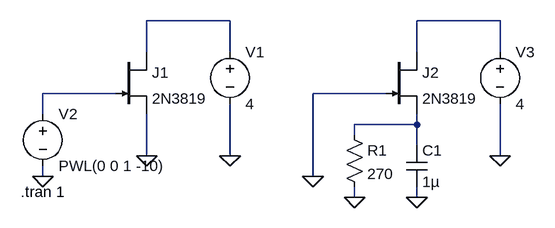
[diagram p0: schematic DC.asc]
DC.asc, the LTspice schematic file:
Version 4
SHEET 1 880 680
WIRE 320 64 192 64
WIRE 736 64 608 64
WIRE 192 112 192 64
WIRE 320 112 320 64
WIRE 608 112 608 64
WIRE 736 112 736 64
WIRE 144 176 32 176
WIRE 560 176 448 176
WIRE 32 208 32 176
WIRE 608 224 608 208
WIRE 608 224 512 224
WIRE 512 240 512 224
WIRE 608 256 608 224
WIRE 192 272 192 208
WIRE 320 272 320 192
WIRE 736 272 736 192
WIRE 32 304 32 288
WIRE 448 304 448 176
WIRE 512 336 512 320
WIRE 608 336 608 320
FLAG 192 272 0
FLAG 32 304 0
FLAG 320 272 0
FLAG 448 304 0
FLAG 736 272 0
FLAG 512 336 0
FLAG 608 336 0
SYMBOL njf 144 112 R0
SYMATTR InstName J1
SYMATTR Value 2N3819
SYMBOL voltage 320 96 R0
WINDOW 123 0 0 Left 2
WINDOW 39 0 0 Left 2
SYMATTR InstName V1
SYMATTR Value 4
SYMBOL voltage 32 192 R0
WINDOW 123 0 0 Left 2
WINDOW 39 0 0 Left 2
SYMATTR InstName V2
SYMATTR Value PWL(0 0 1 -10)
SYMBOL njf 560 112 R0
SYMATTR InstName J2
SYMATTR Value 2N3819
SYMBOL voltage 736 96 R0
WINDOW 123 0 0 Left 2
WINDOW 39 0 0 Left 2
SYMATTR InstName V3
SYMATTR Value 4
SYMBOL res 496 224 R0
SYMATTR InstName R1
SYMATTR Value 270
SYMBOL cap 592 256 R0
SYMATTR InstName C1
SYMATTR Value 1µ
TEXT -2 328 Left 2 !.tran 1

The netlist it stands for:
* DC.asc
J1 N001 N003 0 2N3819
V1 N001 0 4
V2 N003 0 PWL(0 0 1 -10)
J2 N002 0 N004 2N3819
V3 N002 0 4
R1 N004 0 270
C1 N004 0 1µ
.model NJF NJF
.model PJF PJF
.lib standard.jft
.tran 1
.backanno
.end